# Altium schematic sheet 24V_to_5V.SchDoc
size A4
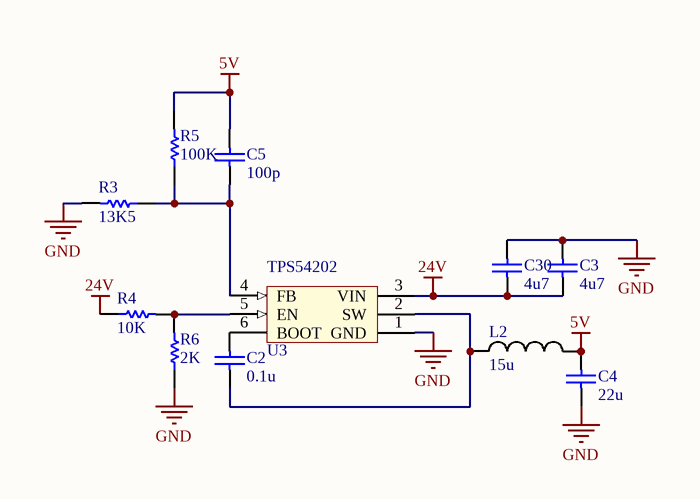
[diagram p0: 24V_to_5V.SchDoc]

## Parts
C2  value 0.1u  [CAPC1608X90N]  (hidden comment: Cap)
C3  value 4u7  [CAPC2012X135N]  (hidden comment: Cap)
C4  value 22u  [CAPC2012X135N]  (hidden comment: Cap)
C5  value 100p  [CAPC1608X90N]  (hidden comment: Cap)
C30  value 4u7  [CAPC2012X135N]  (hidden comment: Cap)
L2  value 15u  [INDC_5.5x5.3x3]  (hidden comment: 15uH inductor)
R3  value 13K5  [RESC1608X55N]  (hidden comment: Res1)
R4  value 10K  [RESC1608X55N]  (hidden comment: Res1)
R5  value 100K  [RESC1608X55N]  (hidden comment: Res1)
R6  value 2K  [RESC1608X55N]  (hidden comment: Res1)
U3  TPS54202  [SOT23-6]

## Nets
5V: C4.2 C5.2 L2.2 R5.2
24V: C3.2 C30.2 R4.1 U3.3(VIN)
GND: C3.1 C4.1 C30.1 R3.2 R6.1 U3.1(GND)
NetC2_1: C2.1 L2.1 U3.2(SW)
NetC2_2: C2.2 U3.6(BOOT)
NetC5_1: C5.1 R3.1 R5.1 U3.4(FB)
NetR4_2: R4.2 R6.2 U3.5(EN)

## Library data of the parts
C2-C5 C30 = Cap: Capacitor; Published: 8-Jun-2000; LatestRevisionDate: 17-Jul-2002; LatestRevisionNote: Re-released for DXP Platform.; PackageReference: RAD-0.3; Publisher: Altium Limited; PackageDescription: Radial Cap, Thru-Hole; 2 Leads; 0.3 in Pin Spacing
L2 = INDC_MPX1D0530L150: 15uH inductor with 2A saturation current. Dimension is 5.5 * 5.2 * 3 mm^3; Saturation Current: 2A
R3-R6 = Res1: Resistor; Published: 8-Jun-2000; LatestRevisionDate: 17-Jul-2002; LatestRevisionNote: Re-released for DXP Platform.; PackageReference: AXIAL-0.3; Publisher: Altium Limited; PackageDescription: Axial Device, Thru-Hole; 2 Leads; 0.3 in Pin Spacing
U3 = TPS54202: 4.5-28V input 2A output step down, EMI Friendly Synchronous Step Down Converter; Vin(max): 28V; Vin(min): 4.5V; Currrent: 2A